# EAGLE design PCB-ETH-TALLY (EAGLE 7.7.0)
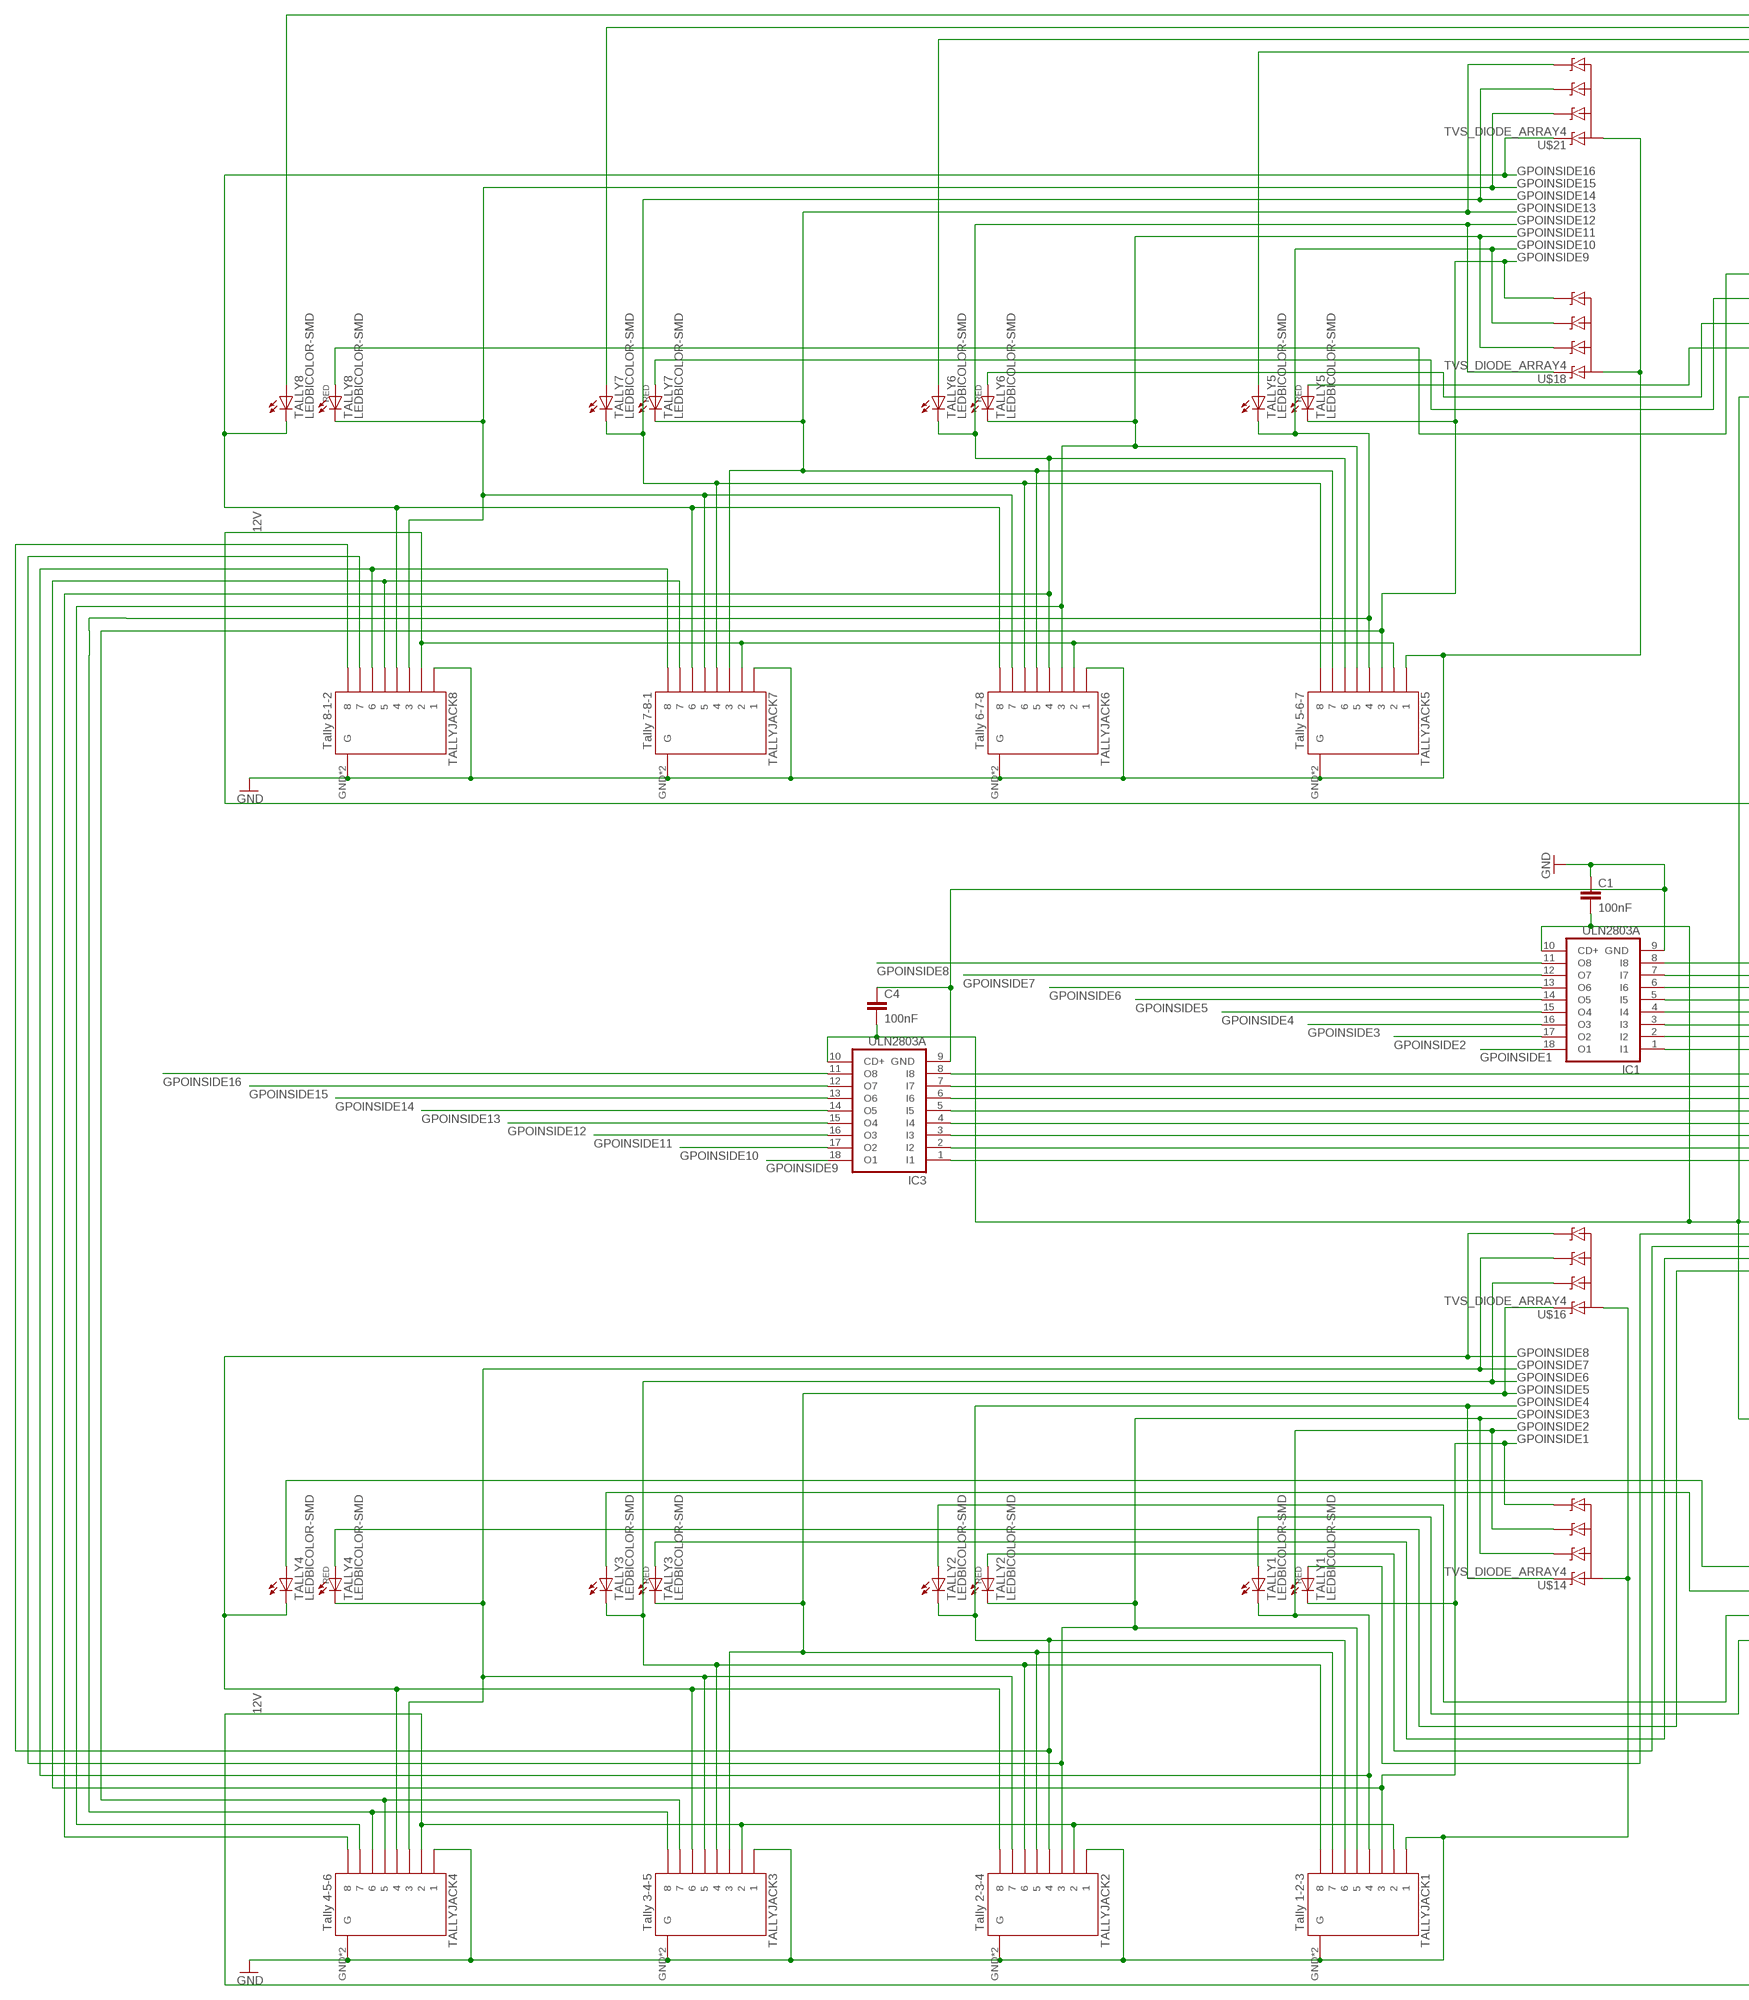
[diagram p0: schematic, sheet 1, part 1 of 2]
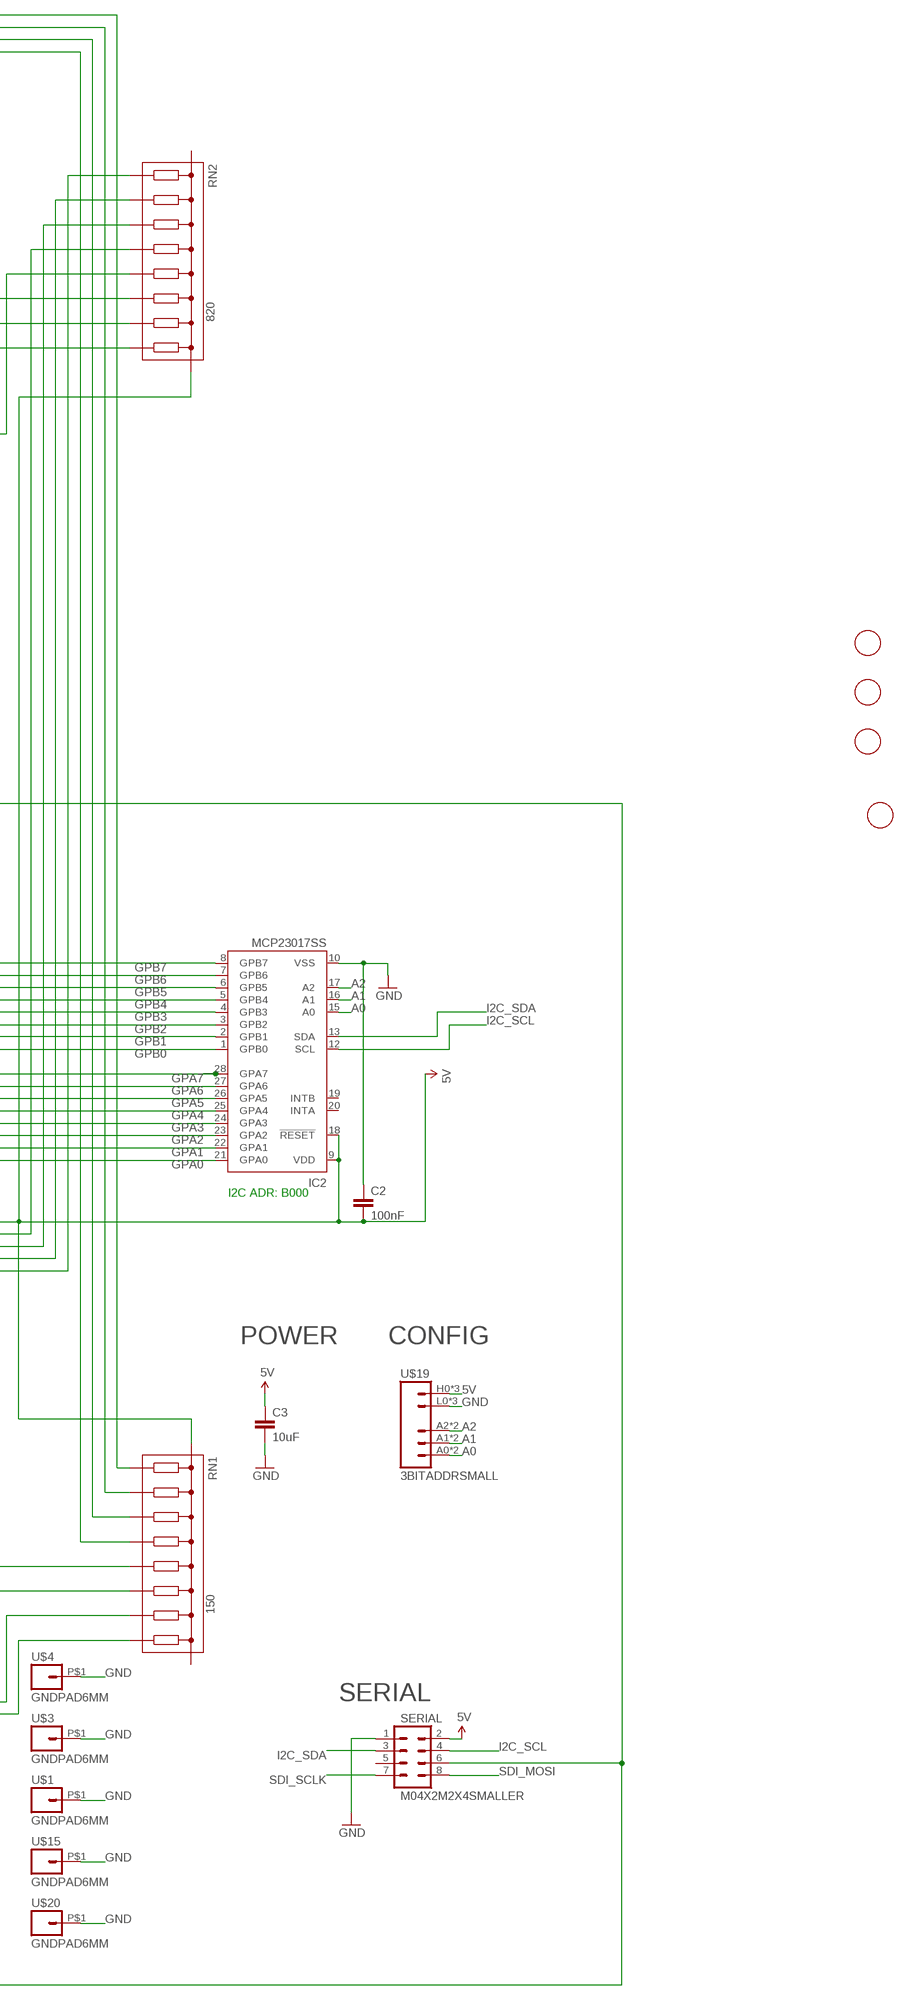
[diagram p1: schematic, sheet 1, part 2 of 2]

## Parts
C1  100nF  CAP0805  [0805]
C2  100nF  CAP0603-CAP  [0603-CAP]
C3  10uF  CAP0805  [0805]
C4  100nF  CAP0805  [0805]
IC1  ULN2803A  ULN2803ASO18W  [SO18W]
IC2  MCP23017SS  [SSOP28]
IC3  ULN2803A  ULN2803ASO18W  [SO18W]
RN1  150  EXBE  [EXBE]
RN2  820  EXBE  [EXBE]
SERIAL  M04X2M2X4SMALLER  [M2X4SMALLER]
TALLY1  LEDBICOLOR-SMD  [LEDBICOLOR-SMD]
TALLY2  LEDBICOLOR-SMD  [LEDBICOLOR-SMD]
TALLY3  LEDBICOLOR-SMD  [LEDBICOLOR-SMD]
TALLY4  LEDBICOLOR-SMD  [LEDBICOLOR-SMD]
TALLY5  LEDBICOLOR-SMD  [LEDBICOLOR-SMD]
TALLY6  LEDBICOLOR-SMD  [LEDBICOLOR-SMD]
TALLY7  LEDBICOLOR-SMD  [LEDBICOLOR-SMD]
TALLY8  LEDBICOLOR-SMD  [LEDBICOLOR-SMD]
TALLYJACK1  Tally 1-2-3  RJ45-8_GNDUPRIGHT  [RJ45-8_GND_UPRIGHT]
TALLYJACK2  Tally 2-3-4  RJ45-8_GNDUPRIGHT  [RJ45-8_GND_UPRIGHT]
TALLYJACK3  Tally 3-4-5  RJ45-8_GNDUPRIGHT  [RJ45-8_GND_UPRIGHT]
TALLYJACK4  Tally 4-5-6  RJ45-8_GNDUPRIGHT  [RJ45-8_GND_UPRIGHT]
TALLYJACK5  Tally 5-6-7  RJ45-8_GNDUPRIGHT  [RJ45-8_GND_UPRIGHT]
TALLYJACK6  Tally 6-7-8  RJ45-8_GNDUPRIGHT  [RJ45-8_GND_UPRIGHT]
TALLYJACK7  Tally 7-8-1  RJ45-8_GNDUPRIGHT  [RJ45-8_GND_UPRIGHT]
TALLYJACK8  Tally 8-1-2  RJ45-8_GNDUPRIGHT  [RJ45-8_GND_UPRIGHT]
U$1  GNDPAD6MM  [3.2MMPAD6MM]
U$3  GNDPAD6MM  [3.2MMPAD6MM]
U$4  GNDPAD6MM  [3.2MMPAD6MM]
U$5  FIDUCIAL  [FIDUCIAL_1MM]
U$6  FIDUCIAL  [FIDUCIAL_1MM]
U$8  FIDUCIAL  [FIDUCIAL_1MM]
U$9  FIDUCIAL  [FIDUCIAL_1MM]
U$14  TVS_DIODE_ARRAY4  [SOT23-6L]
U$15  GNDPAD6MM  [3.2MMPAD6MM]
U$16  TVS_DIODE_ARRAY4  [SOT23-6L]
U$18  TVS_DIODE_ARRAY4  [SOT23-6L]
U$19  3BITADDRSMALL  [3BITADDR_SMALL]
U$20  GNDPAD6MM  [3.2MMPAD6MM]
U$21  TVS_DIODE_ARRAY4  [SOT23-6L]

## Nets
5V [Power]: C1.2 C2.2 C3.1 C4.2 IC1.10(CD+) IC2.9(VDD) IC2.18(!RESET) IC3.10(CD+) RN1.1(POL) RN2.6(POL) SERIAL.2 U$19.H0(VCC) U$19.H1(VCC) U$19.H2(VCC)
12V [Power]: SERIAL.6 TALLYJACK1.2 TALLYJACK2.2 TALLYJACK3.2 TALLYJACK4.2 TALLYJACK5.2 TALLYJACK6.2 TALLYJACK7.2 TALLYJACK8.2
A0: IC2.15(A0) U$19.A0 U$19.AS0(A0)
A1: IC2.16(A1) U$19.A1 U$19.AS1(A1)
A2: IC2.17(A2) U$19.A2 U$19.AS2(A2)
GND [Power]: C1.1 C2.1 C3.2 C4.1 IC1.9(GND) IC2.10(VSS) IC3.9(GND) SERIAL.1 TALLYJACK1.1 TALLYJACK1.GND1(G) TALLYJACK1.GND(G) TALLYJACK2.1 TALLYJACK2.GND1(G) TALLYJACK2.GND(G) TALLYJACK3.1 TALLYJACK3.GND1(G) TALLYJACK3.GND(G) TALLYJACK4.1 TALLYJACK4.GND1(G) TALLYJACK4.GND(G) TALLYJACK5.1 TALLYJACK5.GND1(G) TALLYJACK5.GND(G) TALLYJACK6.1 TALLYJACK6.GND1(G) TALLYJACK6.GND(G) TALLYJACK7.1 TALLYJACK7.GND1(G) TALLYJACK7.GND(G) TALLYJACK8.1 TALLYJACK8.GND1(G) TALLYJACK8.GND(G) U$1.P$1 U$3.P$1 U$4.P$1 U$14.2(GND) U$14.5(GND) U$15.P$1 U$16.2(GND) U$16.5(GND) U$18.2(GND) U$18.5(GND) U$19.L0(GND) U$19.L1(GND) U$19.L2(GND) U$20.P$1 U$21.2(GND) U$21.5(GND)
GPA0: IC2.21(GPA0) IC3.1(I1)
GPA1: IC2.22(GPA1) IC3.2(I2)
GPA2: IC2.23(GPA2) IC3.3(I3)
GPA3: IC2.24(GPA3) IC3.4(I4)
GPA4: IC2.25(GPA4) IC3.5(I5)
GPA5: IC2.26(GPA5) IC3.6(I6)
GPA6: IC2.27(GPA6) IC3.7(I7)
GPA7: IC2.28(GPA7) IC3.8(I8)
GPB0: IC1.1(I1) IC2.1(GPB0)
GPB1: IC1.2(I2) IC2.2(GPB1)
GPB2: IC1.3(I3) IC2.3(GPB2)
GPB3: IC1.4(I4) IC2.4(GPB3)
GPB4: IC1.5(I5) IC2.5(GPB4)
GPB5: IC1.6(I6) IC2.6(GPB5)
GPB6: IC1.7(I7) IC2.7(GPB6)
GPB7: IC1.8(I8) IC2.8(GPB7)
GPOINSIDE1: IC1.18(O1) TALLY1.P$2(C) TALLYJACK1.3 TALLYJACK7.7 TALLYJACK8.5 U$14.6(D)
GPOINSIDE2: IC1.17(O2) TALLY1.P$4(C1) TALLYJACK1.4 TALLYJACK7.8 TALLYJACK8.6 U$14.4(C)
GPOINSIDE3: IC1.16(O3) TALLY2.P$2(C) TALLYJACK1.5 TALLYJACK2.3 TALLYJACK8.7 U$14.3(B)
GPOINSIDE4: IC1.15(O4) TALLY2.P$4(C1) TALLYJACK1.6 TALLYJACK2.4 TALLYJACK8.8 U$14.1(A)
GPOINSIDE5: IC1.14(O5) TALLY3.P$2(C) TALLYJACK1.7 TALLYJACK2.5 TALLYJACK3.3 U$16.1(A)
GPOINSIDE6: IC1.13(O6) TALLY3.P$4(C1) TALLYJACK1.8 TALLYJACK2.6 TALLYJACK3.4 U$16.3(B)
GPOINSIDE7: IC1.12(O7) TALLY4.P$2(C) TALLYJACK2.7 TALLYJACK3.5 TALLYJACK4.3 U$16.4(C)
GPOINSIDE8: IC1.11(O8) TALLY4.P$4(C1) TALLYJACK2.8 TALLYJACK3.6 TALLYJACK4.4 U$16.6(D)
GPOINSIDE9: IC3.18(O1) TALLY5.P$2(C) TALLYJACK3.7 TALLYJACK4.5 TALLYJACK5.3 U$18.6(D)
GPOINSIDE10: IC3.17(O2) TALLY5.P$4(C1) TALLYJACK3.8 TALLYJACK4.6 TALLYJACK5.4 U$18.4(C)
GPOINSIDE11: IC3.16(O3) TALLY6.P$2(C) TALLYJACK4.7 TALLYJACK5.5 TALLYJACK6.3 U$18.3(B)
GPOINSIDE12: IC3.15(O4) TALLY6.P$4(C1) TALLYJACK4.8 TALLYJACK5.6 TALLYJACK6.4 U$18.1(A)
GPOINSIDE13: IC3.14(O5) TALLY7.P$2(C) TALLYJACK5.7 TALLYJACK6.5 TALLYJACK7.3 U$21.6(D)
GPOINSIDE14: IC3.13(O6) TALLY7.P$4(C1) TALLYJACK5.8 TALLYJACK6.6 TALLYJACK7.4 U$21.4(C)
GPOINSIDE15: IC3.12(O7) TALLY8.P$2(C) TALLYJACK6.7 TALLYJACK7.5 TALLYJACK8.3 U$21.3(B)
GPOINSIDE16: IC3.11(O8) TALLY8.P$4(C1) TALLYJACK6.8 TALLYJACK7.6 TALLYJACK8.4 U$21.1(A)
I2C_SCL: IC2.12(SCL) SERIAL.4
I2C_SDA: IC2.13(SDA) SERIAL.3
N$1: RN2.10 TALLY5.P$1(A)
N$2: RN2.9 TALLY6.P$1(A)
N$3: RN2.8 TALLY7.P$1(A)
N$4: RN2.7 TALLY8.P$1(A)
N$5: RN2.5 TALLY1.P$1(A)
N$6: RN2.4 TALLY2.P$1(A)
N$7: RN2.2 TALLY4.P$1(A)
N$8 [Power]: RN2.3 TALLY3.P$1(A)
N$9: RN1.10 TALLY1.P$3(A1)
N$10: RN1.9 TALLY2.P$3(A1)
N$11: RN1.8 TALLY3.P$3(A1)
N$12: RN1.7 TALLY4.P$3(A1)
N$13: RN1.5 TALLY5.P$3(A1)
N$14: RN1.4 TALLY6.P$3(A1)
N$15: RN1.3 TALLY7.P$3(A1)
N$16: RN1.2 TALLY8.P$3(A1)
SDI_MOSI: SERIAL.8
SDI_SCLK: SERIAL.7
Unconnected: IC2.19(INTB) IC2.20(INTA) RN1.6(POL) RN2.1(POL) SERIAL.5

## Notes on the sheet
- I2C ADR: B000
- POWER | CONFIG
- SERIAL

## Library data of the parts
C1-C4 = SparkFun:CAP: Capacitor Standard 0603 ceramic capacitor, and 0.1" leaded capacitor.
IC1 IC3 = uln-udn:ULN2803A: DRIVER ARRAY
IC2 = microchip:MCP23017: http://ww1.microchip.com/downloads/en/DeviceDoc/21952a.pdf Source: http://ww1.microchip.com/downloads/en/DeviceDoc/21952a.pdf; MF: MICROCHIP; MPN: MCP23017-E/SS; OC_FARNELL: 1467674; OC_NEWARK: 31K2960
RN1 RN2 = m-pad-2.1:EXB*: Panasonic EXBA,EXBD,EXBE Chip Resistor Networks
SERIAL = SKAARHOJ:M04X2
TALLY1-TALLY8 = SKAARHOJ:LEDBICOLOR-SMD
TALLYJACK1-TALLYJACK8 = SKAARHOJ:RJ45-8_GND
U$1 U$3 U$4 U$15 U$20 = SKAARHOJ:GNDPAD
U$5 U$6 U$8 U$9 = adafruit:FIDUCIAL: For use by pick and place machines to calibrate the vision/machine, 1mm By microbuilder.eu
U$14 U$16 U$18 U$21 = SKAARHOJ:TVS_DIODE_ARRAY4
U$19 = SKAARHOJ:3BITADDR

## Net classes
0 default: width 0.203 mm, drill 0.406 mm, clearance 0.203 mm
1 Power: width 0.406 mm, drill 0.61 mm, clearance 0.203 mm
2 RELAY LINES: width 0.305 mm, clearance 0.254 mm
3 INput lines: clearance 0.254 mm

## Board
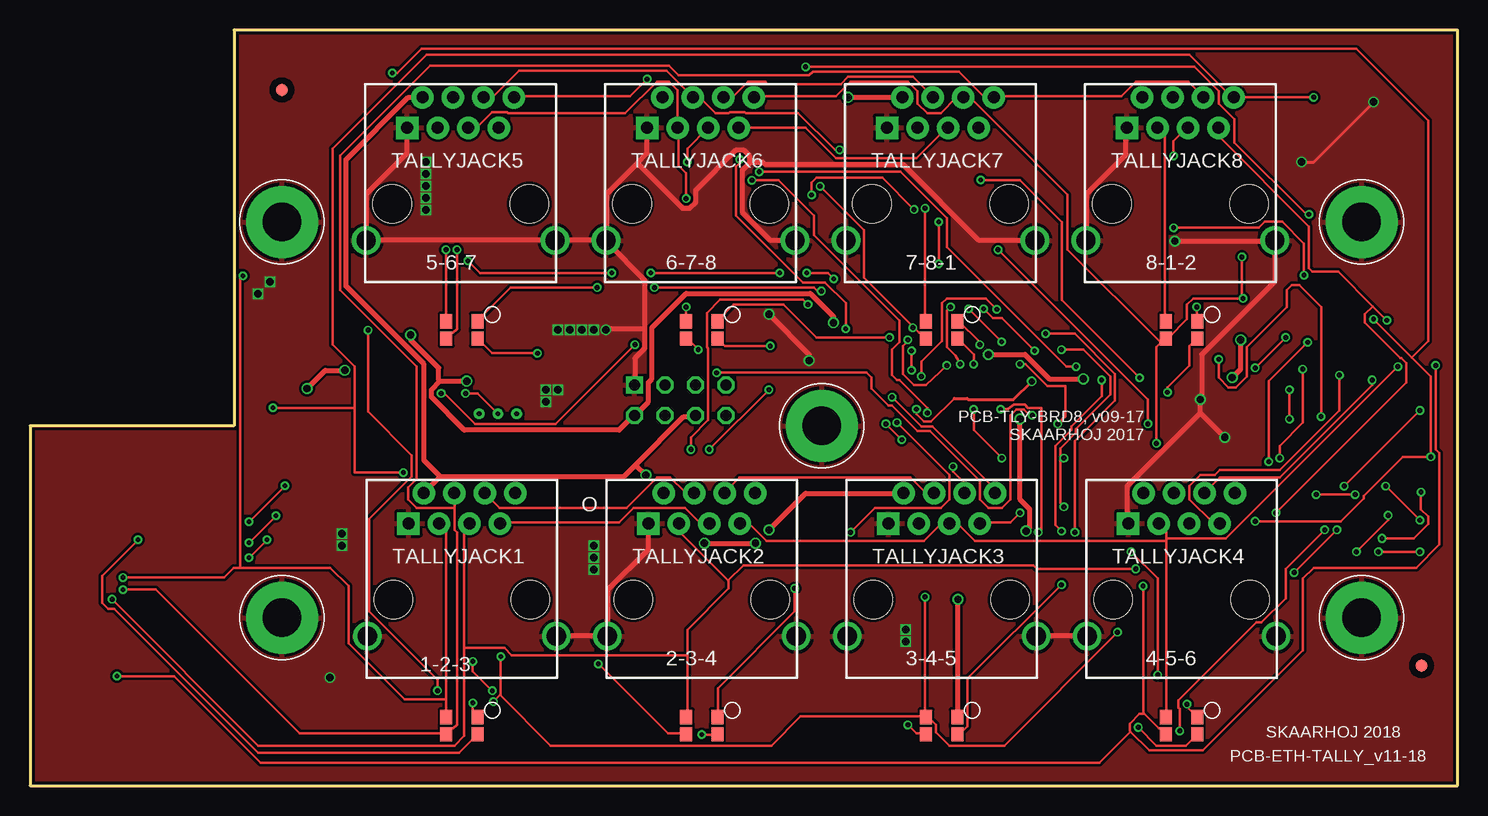
[diagram p2: board, top side]
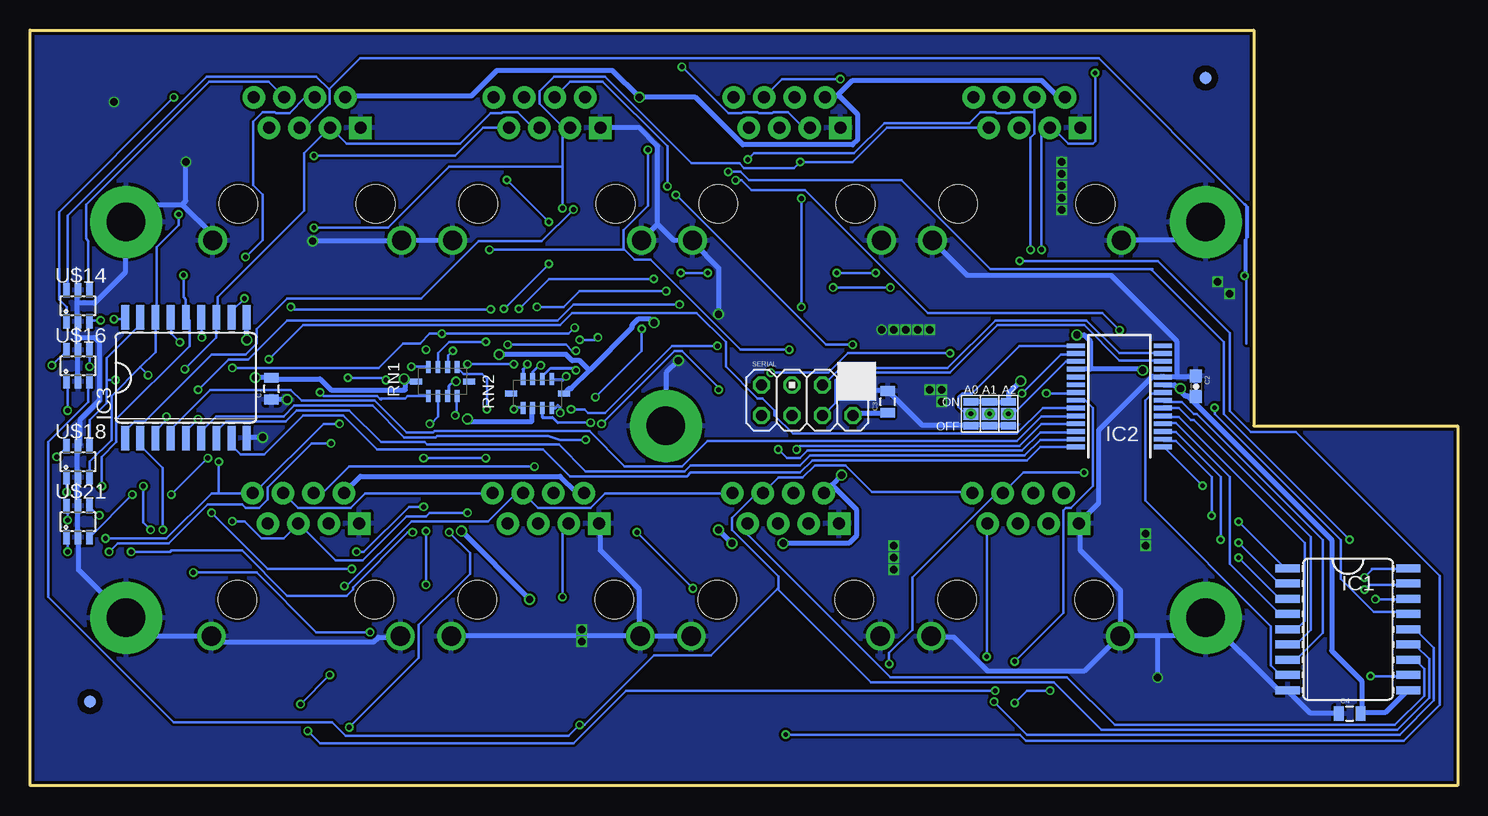
[diagram p3: board, bottom side, seen from below]

Size 119 x 63 mm. Coordinates in mm from the lower left corner, seen from the top.
Outline: 0,0 119,0 119,63 17,63 17,30 0,30 0,0
Copper layers (1*16): Top 0.035mm / dielectric 1.5mm / Bottom 0.035mm
Design rules "Fusion_eagle_rule_v1.1": minimum track width 6mil, minimum drill 12mil, track to track 6mil, track to pad 6mil, pad to pad 6mil, via to via 6mil, smd to smd 0mil, copper to edge 10mil, drill to drill 10mil, minimum pad ring 10mil, minimum via ring 6mil, stop-mask expansion 2mil, vias tented up to drill 100mil, thermal gap 10mil

### Footprints (pad centres in the part's own frame; a part is rotated, then mirrored left to right if it is on the bottom)
0805 = smd 0.8 x 1.2: 1 -0.9,0; 2 0.9,0
0603-CAP = smd 1.1 x 1: 1 -0.85,0; 2 0.85,0
SO18W = smd 0.66 x 2.032: 1 -5.08,-5.029; 2 -3.81,-5.029; 3 -2.54,-5.029; 4 -1.27,-5.029; 5 0,-5.029; 6 1.27,-5.029; 7 2.54,-5.029; 8 3.81,-5.029; 9 5.08,-5.029; 10 5.08,5.029; 11 3.81,5.029; 12 2.54,5.029; 13 1.27,5.029; 14 0,5.029; 15 -1.27,5.029; 16 -2.54,5.029; 17 -3.81,5.029; 18 -5.08,5.029
SSOP28 = smd 0.4 x 1.5: 1 -4.225,-3.625; 2 -3.575,-3.625; 3 -2.925,-3.625; 4 -2.275,-3.625; 5 -1.625,-3.625; 6 -0.975,-3.625; 7 -0.325,-3.625; 8 0.325,-3.625; 9 0.975,-3.625; 10 1.625,-3.625; 11 2.275,-3.625; 12 2.925,-3.625; 13 3.575,-3.625; 14 4.225,-3.625; 15 4.225,3.625; 16 3.575,3.625; 17 2.925,3.625; 18 2.275,3.625; 19 1.625,3.625; 20 0.975,3.625; 21 0.325,3.625; 22 -0.325,3.625; 23 -0.975,3.625; 24 -1.625,3.625; 25 -2.275,3.625; 26 -2.925,3.625; 27 -3.575,3.625; 28 -4.225,3.625
EXBE = smd 1 x 0.5: 1 -2.2,0; 6 2.2,0 | smd 0.4 x 1: 2 -1.2,-1.2; 3 -0.4,-1.2; 4 0.4,-1.2; 5 1.2,-1.2; 7 1.2,1.2; 8 0.4,1.2; 9 -0.4,1.2; 10 -1.2,1.2
M2X4SMALLER = drill 0.9 square: 1 -1.27,3.81 | drill 0.9 octagon: 2 1.27,3.81; 3 -1.27,1.27; 4 1.27,1.27; 5 -1.27,-1.27; 6 1.27,-1.27; 7 -1.27,-3.81; 8 1.27,-3.81
LEDBICOLOR-SMD = smd 1 x 1.2: P$1 1.3,0.725; P$2 -1.3,0.725; P$3 1.3,-0.725; P$4 -1.3,-0.725
RJ45-8_GND_UPRIGHT = drill 1 pad 1.88 square: 1 -4.445,6.35 | drill 1 pad 1.88: 2 -3.175,8.89; 3 -1.905,6.35; 4 -0.635,8.89; 5 0.635,6.35; 6 1.905,8.89; 7 3.175,6.35; 8 4.445,8.89 | drill 1.6: GND -7.88,-3.05; GND1 7.88,-3.05 | hole 3.2: -5.715,0; 5.715,0
3.2MMPAD6MM = drill 3.2 pad 6: P$1 0,0
FIDUCIAL_1MM = smd 1 x 1: 1 0,0
SOT23-6L = smd 0.55 x 1.2: 1 -0.95,-1.3; 2 0,-1.3; 3 0.95,-1.3; 4 0.95,1.3; 5 0,1.3; 6 -0.95,1.3
3BITADDR_SMALL = drill 0.4: A0 -1.565,0; A1 0,0; A2 1.565,0 | smd 1.27 x 1: AS0 -1.565,0; AS1 0,0; AS2 1.565,0 | smd 1.27 x 0.635: H0 -1.565,1; H1 0,1; H2 1.565,1; L0 -1.565,-1; L1 0,-1; L2 1.565,-1

### Placement (x,y rotation side)
C1  98.87,33.09 90 bottom
C2  21.8,33.29 270 bottom
C3  47.5,32 90 bottom
C4  9,6 0 bottom
IC1  9.13,13.03 270 bottom
IC2  28.19,32.45 90 bottom
IC3  106,34 0 bottom
RN1  84.6,33.7 0 bottom
RN2  76.7,32.7 0 bottom
SERIAL  54.21,32.12 270 bottom
TALLY1  36,5 0 top
TALLY2  56,5 0 top
TALLY3  76,5 0 top
TALLY4  96,5 0 top
TALLY5  36,38 0 top
TALLY6  56,38 0 top
TALLY7  76,38 0 top
TALLY8  96,38 0 top
TALLYJACK1  36,15.5 0 top
TALLYJACK2  56,15.5 0 top
TALLYJACK3  76,15.5 0 top
TALLYJACK4  96,15.5 0 top
TALLYJACK5  35.9,48.5 0 top
TALLYJACK6  55.9,48.5 0 top
TALLYJACK7  75.9,48.5 0 top
TALLYJACK8  95.9,48.5 0 top
U$1  111,47 0 top
U$3  21,47 0 top
U$4  66,30 0 top
U$5  21,59 0 bottom
U$6  114,7 0 bottom
U$8  21,58 0 top
U$9  116,10 0 top
U$14  115,40 0 bottom
U$15  21,14 0 top
U$16  115,35 0 bottom
U$18  115,27 0 bottom
U$19  39,31 0 bottom
U$20  111,14 0 top
U$21  115,22 0 bottom

### Tracks (layer width: path | path; a pad name or v marks a point on that pad's centre or on a via)
5V  (via drill 0.61)
  Top 0.406: v26.25,34.62 24.62,34.62 v23.09,33.1 | v100.92,37.16 100.92,34.73 v100.21,34.01 | v66.99,38.59 66.99,39.09 65.06,41.02 54.69,41.02 51.85,38.18 51.85,33.91 51.54,33.61 51.54,31.98 50.43,30.87 SERIAL.2 50.22,30.76 49.1,29.65 36.2,29.65 33.46,32.39 33.46,33 34.17,33.71 | 34.17,33.71 v36.41,33.71 | v87.81,33.91 84.97,33.91 82.94,35.95 v79.89,35.95 | v31.73,37.57 31.73,37.16 34.07,34.83 34.07,33.81 34.17,33.71
  Bottom 0.406: IC1.10 4.2,7.9 6.03,6.07 8.06,6.07 C4.2 8,6.25 8,8.75 10.5,11.25 10.5,20.5 22.5,32.5 22.5,32.49 | 22.5,32.49 22.69,32.49 23.2,33 | 22.5,32.49 21.88,32.49 C2.2 21.67,32.29 | 23.2,33 23.6,33.41 24.52,33.41 IC2.9 | 30.61,34.73 26.35,34.73 v26.25,34.62 | 30.61,34.73 31.73,34.73 IC2.18 | v23.09,33.1 23.2,33 | 87.75,33 93.91,33 94.83,33.91 98.79,33.91 C1.2 98.99,34.01 v100.21,34.01 | 87.75,33 87.71,33 | v100.92,37.16 100.92,38.99 IC3.10 | U$19.H0 40.47,31.98 39.15,31.98 U$19.H1 38.95,31.98 37.52,31.98 U$19.H2 37.42,32.19 37.42,32.69 v36.41,33.71 | 72.37,34.62 68.81,38.18 68.81,38.38 68.31,38.89 67.29,38.89 v66.99,38.59 | 72.37,34.62 73.89,33.1 74.1,33.1 RN2.6 | C3.1 47.58,31.07 50.12,31.07 50.32,30.87 SERIAL.2 | v87.81,33.91 87.71,33.81 87.71,33.2 87.75,33 | v79.89,35.95 74.3,35.95 73.79,35.44 73.18,35.44 72.37,34.62 | 30.61,34.73 30.61,37.06 31.12,37.57 v31.73,37.57 | 87.75,33.75 v87.81,33.91 | RN1.1 86.9,33.71 87.61,33.71 v87.81,33.91
12V  (via drill 0.61)
  Top 0.406: v68.21,57.38 72.68,57.38 TALLYJACK7.2 | 50.48,26.75 49.51,25.79 34.17,25.79 | 50.48,26.75 54.49,30.76 55.4,30.76 SERIAL.6 | 34.17,25.79 32.85,24.46 TALLYJACK1.2 | 50.48,26.75 v51.34,25.89 | v61.6,21.31 64.65,24.36 72.78,24.36 TALLYJACK3.2 | v56.22,20.2 v60.48,20.2 | 34.17,25.79 32.85,27.11 32.85,35.13 26.35,41.63 26.35,52.2 31.53,57.38 32.65,57.38 TALLYJACK5.2
  Bottom 0.406: 51.65,57.59 51.75,57.48 52.66,57.48 TALLYJACK6.2 | 51.65,57.59 50.43,58.8 34.68,58.8 33.36,57.48 32.75,57.48 TALLYJACK5.2 | 51.65,57.59 50.02,55.96 50.02,53.83 50.43,53.42 59.57,53.42 63.53,57.38 v68.21,57.38 70.44,59.62 80.09,59.62 82.23,57.48 92.69,57.48 TALLYJACK8.2 | TALLYJACK3.2 72.88,24.46 73.49,24.46 74.81,25.79 91.47,25.79 92.79,24.46 TALLYJACK4.2 | v51.34,25.89 52.15,25.07 | 52.15,25.07 52.76,24.46 TALLYJACK2.2 | v60.48,20.2 v61.6,21.31 | v56.22,20.2 50.73,20.2 50.12,20.81 50.12,23.04 52.15,25.07
A0
  Bottom 0.203: 40.57,30.97 U$19.AS0 40.67,30.97 40.98,30.97 41.59,31.58 41.59,32.39 41.28,32.69 40.47,32.69 36.51,36.66 31.83,36.66 IC2.15
A1  (via drill 0.41)
  Top 0.203: v36.3,32.69 37.32,32.69 38.95,31.07 U$19.AS1
  Bottom 0.203: 39.05,30.97 U$19.AS1 | v36.3,32.69 33.05,35.95 31.83,35.95 IC2.16
A2
  Bottom 0.203: 37.42,30.97 U$19.AS2 37.32,30.97 37.01,30.97 32.65,35.34 31.83,35.34 IC2.17
GND  (via drill 0.6, 0.61)
  Top 0.254: v106,52 107,52 v112,57
  Top 0.406: TALLYJACK3.GND1 83.95,12.48 88.12,12.48 TALLYJACK4.GND | 97.57,31.07 v97.57,32.19 97.67,32.29 97.67,35.95 103.77,42.04 103.77,45.39 TALLYJACK8.GND1 103.56,45.39 v95.43,45.39 | 97.57,31.07 91.47,24.97 91.47,21.92 TALLYJACK4.1 | 97.57,31.07 v99.6,29.04 | TALLYJACK2.1 51.54,21.82 51.54,19.69 48.19,16.34 48.19,12.48 TALLYJACK2.GND 47.99,12.48 43.92,12.48 TALLYJACK1.GND1 | TALLYJACK5.1 31.43,54.84 31.43,52.71 28.07,49.36 28.07,45.49 TALLYJACK5.GND 28.28,45.49 43.62,45.49 TALLYJACK5.GND1 43.82,45.49 47.89,45.49 TALLYJACK6.GND | TALLYJACK8.1 91.37,54.84 91.37,52.61 88.12,49.36 88.12,45.49 TALLYJACK8.GND | 50.63,51.9 48.09,49.36 48.09,45.49 TALLYJACK6.GND | 50.63,51.9 51.44,52.71 TALLYJACK6.1 | 51.24,38.08 51.24,42.14 48.09,45.29 TALLYJACK6.GND | 51.24,38.08 51.24,36.45 50.43,35.64 50.43,33.41 SERIAL.1 | 59.98,51.9 59.37,51.29 59.37,47.83 61.7,45.49 63.73,45.49 TALLYJACK6.GND1 | 59.98,51.9 59.98,52.51 59.47,53.01 58.86,53.01 55.51,49.66 55.51,48.65 55,48.14 54.39,48.14 50.63,51.9 | TALLYJACK7.GND1 83.75,45.49 79.08,45.49 72.78,51.79 61.3,51.79 61.09,52 60.08,52 59.98,51.9 | v64.95,35.44 64.95,35.95 v61.6,39.3 | 51.24,38.08 48.09,38.08 v48,38
  Bottom 0.406: TALLYJACK3.1 71.46,21.82 71.46,19.59 68.21,16.34 68.21,12.48 TALLYJACK3.GND | TALLYJACK2.GND1 63.94,12.48 68,12.48 TALLYJACK3.GND | TALLYJACK3.GND1 83.85,12.48 68.41,12.48 TALLYJACK3.GND | v97.57,32.19 98.79,32.19 C1.1 | v99.6,29.04 100.82,29.04 IC3.9 | U$16.2 115.04,33.71 115.04,36.25 U$16.5 115.04,36.45 115.04,37.37 | 115.04,37.37 115.04,38.69 U$14.2 115.04,38.89 115.04,40.21 | 115.04,40.21 115.04,41.23 U$14.5 | 115.04,40.21 113.62,40.21 111.08,42.75 111.08,46.92 U$1.P$1 110.88,47.12 109.56,48.44 106.31,48.44 | 106.31,48.44 103.87,46 103.87,45.49 TALLYJACK8.GND1 | 115.04,37.37 113.62,37.37 113.21,36.96 113.21,32.08 114.84,30.46 114.84,28.43 U$18.5 115.04,28.22 115.04,25.89 U$18.2 115.04,25.68 115.04,23.45 U$21.5 115.04,23.25 115.04,20.7 U$21.2 114.94,20.5 114.94,17.96 111.08,14.1 U$20.P$1 110.88,13.9 109.45,12.48 103.97,12.48 TALLYJACK4.GND1 103.66,12.48 103.16,11.97 90.35,11.97 89.95,12.37 88.22,12.37 TALLYJACK4.GND | 23.4,34.12 24.52,34.12 IC2.10 24.72,34.12 25.43,34.12 29.9,29.65 29.9,23.55 31.53,21.92 TALLYJACK1.1 31.43,21.72 31.43,19.59 28.07,16.23 28.07,12.68 TALLYJACK1.GND | 23.4,34.12 21.88,34.12 C2.1 | C4.1 9.99,6.07 12.33,6.07 14.15,7.9 IC1.9 14.36,8.01 14.97,8.01 20.96,14 U$15.P$1 21.16,13.9 22.59,12.48 25.03,12.48 | 25.03,12.48 28.07,12.48 TALLYJACK1.GND | TALLYJACK1.GND1 43.82,12.37 41.99,12.37 39.15,9.53 31.12,9.53 28.28,12.37 TALLYJACK1.GND | TALLYJACK5.GND 27.97,45.49 22.49,45.49 21.06,46.92 U$3.P$1 | TALLYJACK7.GND1 83.85,45.49 88.02,45.49 TALLYJACK8.GND 88.22,45.39 v95.43,45.39 | 66.68,46.82 66.68,53.32 68.21,54.84 71.36,54.84 TALLYJACK7.1
  Bottom 0.406: 66.68,46.82 68,45.49 TALLYJACK7.GND | 66.68,46.82 65.36,45.49 63.84,45.49 TALLYJACK6.GND1 63.73,45.29 61.6,43.16 v61.6,39.3 | U$19.L2 37.52,30.05 38.95,30.05 U$19.L1 39.15,30.05 40.47,30.05 U$19.L0 40.67,30.05 44.63,30.05 47.38,32.8 C3.2 47.58,33 50.02,33 50.32,33.3 SERIAL.1 | v64.95,35.44 65.97,34.42 65.97,30.05 U$4.P$1 | 23.4,34.12 23.4,37.06 28.89,42.55 40.88,42.55 43.72,45.39 TALLYJACK5.GND1 | 25.03,12.48 25.03,9.02 v25,9 | 106.31,48.44 106,48.75 v106,52
  other vias: 19,41 20,42 33,48 33,49 33,50 33,51 33,52 44,38 45,38 46,38 47,38 43,33 44,33 43,32 73,12 73,13 47,18 47,19 47,20 26,20 26,21
  pour Top: 0,0 119,0 119,63 0,63
  pour Bottom: 0,0 119,0 119,63 0,63
GPA0  (via drill 0.41)
  Top 0.203: v34.27,32.69 34.58,32.69 37.12,30.15 43.82,30.15 v50.43,36.76 | v65.16,49.25 65.16,50.27 65.56,50.68 71.05,50.68 v73.69,48.03
  Bottom 0.203: v34.27,32.69 31.83,32.69 IC2.21 | v50.43,36.76 52.66,36.76 v65.16,49.25 | v73.69,48.03 76.33,45.39 81.62,45.39 86.39,40.62 97.57,40.62 100.11,38.08 100.11,36.86 101.02,35.95 103.87,35.95 109.45,30.36 110.27,30.36 110.98,29.65 110.98,29.04 IC3.1
GPA1  (via drill 0.41)
  Top 0.203: v36.91,10.34 36.91,9.53 v38.54,7.9 | v95.84,4.55 95.84,6.38 95.74,6.48 95.74,7.09 102.24,13.59 102.65,13.59 104.68,15.62 104.68,18.06 v107.93,21.31
  Bottom 0.203: v36.91,10.34 32.85,14.41 32.85,22.94 32.65,23.14 32.24,23.14 30.41,24.97 30.41,31.47 31.02,32.08 31.73,32.08 IC2.22 | v38.54,7.9 69.32,7.9 73.69,3.53 94.83,3.53 v95.84,4.55 | v107.93,21.31 107.93,26.5 109.76,28.33 109.76,28.93 IC3.2
GPA2  (via drill 0.41)
  Top 0.203: v99.09,35.54 99.09,34.01 99.91,33.2 100.51,33.2 101.43,34.12 101.43,36.55 104.78,39.91 104.78,41.33 105.19,41.74 105.8,41.74 107.63,39.91 v107.63,30.76
  Bottom 0.203: v99.09,35.54 96.25,38.38 74.81,38.38 73.79,39.4 63.43,39.4 60.99,36.96 60.99,34.93 58.35,32.29 57.94,32.29 56.93,31.27 56.93,30.87 55.4,29.34 36.71,29.34 34.58,31.47 31.83,31.47 IC2.23 | v107.63,30.76 107.63,30.46 108.44,29.65 108.44,29.04 IC3.3
GPA3
  Bottom 0.203: IC2.24 31.83,30.76 34.68,30.76 36.71,28.73 62.52,28.73 64.65,26.6 69.42,26.6 72.37,29.54 74.91,29.54 75.62,29.55 81.72,29.55 82.43,29.54 85.27,29.54 85.38,29.44 87.61,29.44 90.25,32.08 96.35,32.08 97.26,33 103.97,33 107.22,29.75 107.22,29.04 IC3.4
GPA4  (via drill 0.41)
  Top 0.203: v55.1,28.02 55.1,29.04 56.52,30.46 56.52,36.45 56.42,36.55 56.42,39.4 57.54,40.52 64.45,40.52 v64.85,40.11 | v104.98,30.56 v104.98,33
  Bottom 0.203: v55.1,28.02 54.79,28.33 36.51,28.33 34.68,30.15 31.83,30.15 IC2.25 | v64.85,40.11 73.69,40.11 75.01,38.79 97.57,38.79 100.82,35.54 102.44,35.54 v104.98,33 | v104.98,30.56 105.9,29.65 105.9,29.04 IC3.5
GPA5  (via drill 0.41)
  Top 0.203: v61.6,33 v56.62,28.02 | v72.68,28.83 v71.36,30.15
  Bottom 0.203: v56.62,28.02 55.91,27.31 54.79,27.31 54.19,27.92 36.3,27.92 34.78,29.44 31.83,29.44 IC2.26 | v61.6,33 61.6,33.2 64.65,36.25 65.26,36.25 v71.36,30.15 | v72.68,28.83 74.81,28.83 75.83,29.15 81.52,29.15 82.23,29.14 85.07,29.14 85.17,29.04 87.81,29.04 90.46,31.68 96.96,31.68 97.87,30.76 103.46,30.76 104.68,29.54 104.68,29.04 IC3.6
GPA6
  Bottom 0.203: IC2.27 31.83,28.83 34.78,28.83 36.1,27.51 53.98,27.51 54.79,26.7 63.94,26.7 64.45,26.19 72.68,26.19 74.91,28.43 85.88,28.43 86.09,28.63 89.75,28.63 92.39,31.27 96.75,31.27 97.67,30.36 102.65,30.36 103.36,29.65 103.36,29.04 IC3.7
GPA7
  Bottom 0.203: IC2.28 31.83,28.22 34.78,28.22 35.9,27.11 53.78,27.11 54.79,26.09 63.94,26.09 64.24,25.79 74,25.79 76.23,28.02 90.05,28.02 92.89,30.87 96.25,30.87 99.5,27.61 101.43,27.61 102.14,28.33 102.14,28.93 IC3.8
GPB0  (via drill 0.41)
  Top 0.203: v18.25,22 v21.25,25
  Bottom 0.203: v21.25,25 24.5,28.25 IC2.1 | v18.25,22 14.25,18 IC1.1
GPB1  (via drill 0.41)
  Top 0.203: v18.25,20.25 v20.5,22.5
  Bottom 0.203: v20.5,22.5 20.5,25.75 23.5,28.75 24.5,28.75 IC2.2 | v18.25,20.25 15,17 14.25,17 IC1.2
GPB2  (via drill 0.41)
  Top 0.203: v18.25,19 v19.75,20.5
  Bottom 0.203: v19.75,20.5 19.75,25.75 23.5,29.5 24.5,29.5 IC2.3 | v18.25,19 15,15.75 14.25,15.75 IC1.3
GPB3
  Bottom 0.203: IC2.4 24.5,30.25 23.5,30.25 19,25.75 19,18.5 15,14.5 14.25,14.5 IC1.4
GPB4
  Bottom 0.203: IC2.5 24.5,30.75 23.25,30.75 12.75,20.25 12.75,13.75 13.25,13.25 14,13.25 IC1.5
GPB5
  Bottom 0.203: IC2.6 24.5,31.5 23.25,31.5 22.25,30.5 22,30.5 12.25,20.75 12.25,13 13.25,12 14,12 IC1.6
GPB6
  Bottom 0.203: IC2.7 24.5,32 23,32 22,31 21.75,31 11.25,20.5 11.25,12.75 13.5,10.5 14,10.5 IC1.7
GPB7
  Bottom 0.203: IC2.8 24.62,32.69 25.43,32.69 26.04,32.08 26.04,23.75 15.58,13.29 15.58,10.04 14.76,9.22 14.26,9.22 IC1.8
GPOINSIDE1  (via drill 0.41)
  Top 0.203: 34.68,7.19 34.68,21.31 34.17,21.82 TALLYJACK1.3 | 34.68,7.19 34.68,5.77 TALLY1.P$2 | v7.75,17.35 16.19,17.35 17,18.16 17.5,18.16 | 17.5,18.16 25.03,18.16 26.55,16.64 26.55,11.87 31.22,7.19 34.68,7.19 | v95.33,52.51 95.33,53.73 96.45,54.84 TALLYJACK8.5 | 17.5,18.16 17.5,42.25 v17.75,42.5
  Bottom 0.203: v7.75,17.35 7.09,18.01 | 7.09,18.01 7.04,18.06 4.2,18.06 IC1.18 | 94.06,58.04 94.01,57.99 94.01,56.87 95.94,54.94 96.45,54.94 TALLYJACK8.5 | 94.06,58.04 95.13,59.11 104.27,59.11 115.86,47.53 115.86,41.33 U$14.6 | v95.33,52.51 83.55,52.51 81.21,54.84 TALLYJACK7.7 | 17.61,36.86 17.61,48.34 17.76,48.49 | 17.76,48.49 29.9,60.63 91.47,60.63 94.06,58.04 | 7.14,18.06 7.09,18.01 | v17.75,42.5 17.75,45.5 17.5,45.75 17.5,48.25 17.75,48.5 17.76,48.49
GPOINSIDE2  (via drill 0.41)
  Top 0.203: TALLYJACK8.6 97.77,57.48 96.55,58.7 92.18,58.7 90.96,57.48 80.4,57.48 TALLYJACK7.8 80.3,57.48 79.48,57.48 77.45,59.52 65.26,59.52 64.95,59.21 54.08,59.21 53.27,60.02 33.36,60.02 25.84,52.51 25.84,41.33 32.24,34.93 32.24,25.58 31.53,24.87 31.53,23.85 32.24,23.14 35.39,23.14 | 35.39,23.14 35.39,24.36 TALLYJACK1.4 | 35.39,23.14 35.39,21.31 35.59,21.11 35.59,5.06 35.29,4.75 35.19,4.75 34.78,4.35 TALLY1.P$4 34.68,4.35 22.49,4.35 10.5,16.34 v7.75,16.34
  Bottom 0.203: U$14.4 114.13,41.33 114.13,45.39 114.33,45.6 114.33,48.44 104.07,58.7 99.09,58.7 97.87,57.48 TALLYJACK8.6 | v7.75,16.34 7.35,16.74 4.2,16.74 IC1.17
GPOINSIDE3  (via drill 0.41)
  Top 0.203: 111.94,39.96 109.05,42.85 106.92,42.85 106.61,43.16 106.61,46.61 99.09,54.13 99.09,54.84 TALLYJACK8.7 | 111.94,39.96 v113.11,38.79 | 54.79,10.85 54.79,12.98 58.25,16.44 58.25,17.05 58.2,17.1 | 54.79,10.85 54.79,5.77 TALLY2.P$2 | 58.2,17.1 54.19,21.11 54.19,21.82 TALLYJACK2.3 | v6.84,15.52 19.03,3.33 35.39,3.33 36.2,4.14 36.2,11.46 | 36.2,11.46 36.2,21.42 36.61,21.82 TALLYJACK1.5 | 54.79,10.85 40.16,10.85 39.55,11.46 36.2,11.46 | 111.94,39.96 111.28,39.3 111.28,38.59 114.23,35.64 114.33,35.64 114.74,35.23 114.74,33.61 v103.87,22.74 | v92.18,18.06 83.95,18.06 83.65,18.37 59.47,18.37 58.2,17.1
  Bottom 0.203: v113.11,38.79 114.03,38.79 U$14.3 | v6.84,15.52 4.2,15.52 IC1.16 | v103.87,22.74 99.19,18.06 v92.18,18.06
GPOINSIDE4  (via drill 0.41)
  Top 0.203: v107.02,57.38 100.41,57.38 TALLYJACK8.8 100.31,57.48 100.11,57.48 96.65,60.94 33.05,60.94 25.23,53.12 25.23,36.76 27.06,34.93 27.06,31.5 | v47.38,10.14 53.17,4.35 54.69,4.35 TALLY2.P$4 | v31.12,26.09 27.06,26.09 27.06,31.5 | TALLYJACK2.4 55.3,24.46 54.59,24.46 53.37,25.68 52.25,25.68 49.71,23.14 39.15,23.14 37.93,24.36 TALLYJACK1.6 | 27.06,31.5 v20.25,31.5
  Bottom 0.203: v107.02,57.38 116.57,47.83 116.57,40.52 115.96,39.91 115.96,38.79 U$14.1 | v47.38,10.14 47.38,11.05 45.45,12.98 45.45,17.35 38.44,24.36 37.93,24.36 TALLYJACK1.6 37.83,24.46 36.2,26.09 v31.12,26.09 | v20.25,31.5 20.25,31 9.75,20.5 9.75,17.25 7,14.5 4.25,14.5 IC1.15
GPOINSIDE5  (via drill 0.41)
  Top 0.203: v74.61,15.73 74.61,5.77 TALLY3.P$2 | v109.56,24.97 v115.86,31.27 | v105.39,17.76 v108.95,21.31 | v90.66,12.78 81.21,3.33 76.64,3.33 75.52,4.45 75.52,5.06 74.91,5.67 74.71,5.67 TALLY3.P$2 | 39.2,7.55 39.25,7.6 v39.25,10.75 | 39.2,7.55 v38.64,6.99 | TALLYJACK2.5 56.62,21.92 55.81,21.92 54.59,23.14 50.32,23.14 49.1,21.92 39.25,21.92 TALLYJACK1.7 | 39.2,7.55 43.41,3.33 61.8,3.33 64.24,5.77 74.5,5.77 TALLY3.P$2
  Bottom 0.203: v74.61,15.73 74.61,21.31 74.1,21.82 TALLYJACK3.3 | v115.86,31.27 115.86,33.61 U$16.1 | v109.56,24.97 109.56,21.92 v108.95,21.31 | v105.39,17.76 100.11,17.76 95.13,12.78 v90.66,12.78 | v38.64,6.99 35.9,4.25 4.81,4.25 1.96,7.09 1.96,11.46 3.49,12.98 4.1,12.98 IC1.14 | v39.25,10.75 39.25,21.82 TALLYJACK1.7
GPOINSIDE6  (via drill 0.41)
  Top 0.203: v73.18,5.06 73.89,4.35 74.61,4.35 TALLY3.P$4 | TALLYJACK3.4 75.32,24.46 74.61,24.46 73.39,25.68 59.16,25.68 57.94,24.46 TALLYJACK2.6
  Bottom 0.203: 56.67,16.39 56.62,16.44 56.62,17.45 60.48,21.31 60.48,22.33 58.45,24.36 57.94,24.36 TALLYJACK2.6 57.84,24.46 56.62,25.68 54.59,25.68 53.58,26.7 51.03,26.7 48.8,24.46 40.47,24.46 TALLYJACK1.8 | 56.67,16.39 62.21,10.85 66.99,10.85 72.78,5.06 v73.18,5.06 74.1,4.14 92.69,4.14 93.81,5.26 107.02,5.26 117.48,15.73 117.48,28.63 114.13,31.98 114.13,33.61 U$16.3 | 56.67,16.39 48.9,8.61 33.66,8.61 29.7,4.65 5.01,4.65 2.37,7.29 2.37,10.54 3.49,11.66 4.1,11.66 IC1.13
GPOINSIDE7  (via drill 0.41)
  Top 0.203: 94.72,20.6 94.72,21.21 94.11,21.82 TALLYJACK4.3 | 94.72,20.6 94.72,20.4 | 94.72,20.4 94.72,5.77 TALLY4.P$2 | v114.03,34.93 99.7,20.6 94.72,20.6 | 94.72,20.4 78.77,20.4 77.35,21.82 76.64,21.82 TALLYJACK3.5 76.54,21.82 75.93,21.82 74.5,20.4 61.4,20.4 59.98,21.82 59.27,21.82 TALLYJACK2.7
  Bottom 0.203: v114.03,34.93 114.03,36.25 U$16.4 | IC1.12 4.1,10.44 3.49,10.44 2.78,9.73 2.78,7.5 5.21,5.06 28.58,5.06 32.54,9.02 47.28,9.02 59.16,20.91 59.16,21.82 TALLYJACK2.7
GPOINSIDE8  (via drill 0.41)
  Top 0.203: 92.84,6.02 92.79,6.07 v92.79,16.64 | 92.84,6.02 94.11,4.75 94.22,4.75 94.62,4.35 TALLY4.P$4 | v117.18,35.03 117.18,28.02 117.48,27.72 117.48,20.09 115.55,18.16 107.02,18.16 106.1,17.25 106.1,11.26 97.77,2.92 93.3,2.92 91.73,4.5 | 91.73,4.5 91.67,4.55 91.67,5.16 92.49,5.97 92.79,5.97 92.84,6.02 | v7.25,9.12 12.02,9.12 19.23,1.91 89.14,1.91 91.73,4.5 | v76.94,26.6 76.94,26.19 77.86,25.28 77.86,24.46 TALLYJACK3.6
  Bottom 0.203: v92.79,16.64 92.59,16.64 87.2,22.03 80.8,22.03 78.47,24.36 77.96,24.36 TALLYJACK3.6 77.86,24.36 76.64,23.14 72.27,23.14 71.05,24.36 60.48,24.36 TALLYJACK2.8 | v117.18,35.03 115.96,36.25 U$16.6 | v7.25,9.12 4.2,9.12 IC1.11 | v76.94,26.6 92.39,26.6 94.52,24.46 95.33,24.46 TALLYJACK4.4
GPOINSIDE9  (via drill 0.41)
  Top 0.203: v34.68,44.68 34.68,38.79 TALLY5.P$2 | v112,38.89 115.2,35.69 | 115.2,35.69 116.77,34.12 v116.77,27.41 114.43,27.41 111.18,24.16 111.18,23.96 109.25,22.03 v102.14,22.03 | v82.53,22.74 81.72,21.92 79.18,21.92 TALLYJACK3.7 | v30.21,59.41 30.61,59.41 32.65,61.45 110.57,61.45 116.57,55.45 116.57,37.06 115.2,35.69
  Bottom 0.203: v34.68,44.68 34.68,54.23 34.07,54.84 TALLYJACK5.3 33.97,54.84 33.76,54.84 32.44,53.52 30.41,53.52 30.21,53.73 v30.21,59.41 | v116.77,27.41 115.96,28.22 U$18.6 | v112,38.89 111.18,38.89 111.08,38.99 IC3.18 | v82.53,22.74 85.68,22.74 85.99,22.43 87.61,22.43 91.27,18.77 93.5,18.77 96.55,21.82 TALLYJACK4.5 96.65,21.82 97.87,20.6 99.7,20.6 101.12,22.03 v102.14,22.03
GPOINSIDE10  (via drill 0.41)
  Top 0.203: v35.59,44.68 35.59,38.08 35.29,37.77 35.19,37.77 34.78,37.37 TALLY5.P$4 | v111.89,33.81 111.89,33.41 104.17,25.68 99.19,25.68 97.97,24.46 TALLYJACK4.6 | v59.16,52.2 59.16,51.9 58.86,51.59 58.86,47.53 64.45,41.94 66.28,41.94 68,40.21 v68,38.08 | v71.86,32.39 74.3,29.95 75.22,29.95 80.4,24.77 80.4,24.46 TALLYJACK3.8
  Bottom 0.203: v35.59,44.68 35.59,54.03 35.29,54.33 35.29,56.16 | 35.29,56.16 35.29,57.38 TALLYJACK5.4 | 112.61,33.81 112.61,35.64 109.86,38.38 109.86,38.99 IC3.17 | 112.61,33.81 112.61,31.88 114.03,30.46 114.03,28.33 U$18.4 | TALLYJACK3.8 80.5,24.36 91.07,24.36 92.28,23.14 96.65,23.14 97.87,24.36 TALLYJACK4.6 | v111.89,33.81 112.61,33.81 | 35.29,56.16 37.22,56.16 37.32,56.06 38.44,56.06 38.54,56.16 39.76,56.16 40.67,55.25 47.78,55.25 50.32,52.71 58.66,52.71 v59.16,52.2 | v68,38.08 68,36.25 v71.86,32.39
GPOINSIDE11  (via drill 0.41)
  Top 0.203: v109.15,34.22 109.15,31.27 104.17,26.29 99.19,26.29 98.79,25.89 97.57,25.89 96.65,24.97 96.65,23.85 98.58,21.92 99.09,21.92 TALLYJACK4.7 | v54.69,39.91 54.69,38.79 TALLY6.P$2 | v54.69,48.95 54.69,51.08 54.08,51.69 54.08,54.84 TALLYJACK6.3 53.98,54.94 53.98,57.99 53.27,58.7 52.25,58.7 49.61,56.06 39.86,56.06 39.76,56.16 38.54,56.16 37.32,54.94 36.61,54.94 TALLYJACK5.5 | v106.61,47.63 106.41,47.63 100.41,53.62 100.41,55.55 99.09,56.87 99.09,57.89 97.06,59.92 v64.65,59.92
  Bottom 0.203: 109.81,34.88 108.54,36.15 108.54,38.99 IC3.16 108.44,39.09 108.44,44.89 106.61,46.71 v106.61,47.63 | 109.81,34.88 112.2,32.49 112.2,28.83 114.03,27 114.03,25.79 U$18.3 | 109.81,34.88 v109.15,34.22 | v54.69,48.95 v54.69,39.91 | v64.65,59.92 60.79,56.06 59.67,56.06 59.57,56.16 58.35,56.16 58.25,56.06 57.13,56.06 57.03,56.16 55.81,56.16 54.59,54.94 54.08,54.94 TALLYJACK6.3
GPOINSIDE12  (via drill 0.41)
  Top 0.203: v115.96,24.46 115.96,23.04 116.57,22.43 116.57,21.82 115.35,20.6 v112.71,20.6 | v106.51,36.96 103.26,33.71 v103.26,27 | v55.71,36.35 54.79,37.27 TALLY6.P$4 | v67.49,53.01 67.09,53.01 64.04,56.06 59.67,56.06 59.57,56.16 58.35,56.16 58.25,56.06 57.13,56.06 55.81,57.38 55.3,57.38 TALLYJACK6.4 55.2,57.48 53.07,59.62 40.77,59.62 38.64,57.48 37.83,57.48 TALLYJACK5.6 | v93.2,30.15 93.2,32.19 v80.7,44.68
  Bottom 0.203: v115.96,24.46 115.96,25.68 U$18.1 | v112.71,20.6 107.63,20.6 103.87,24.36 103.26,24.36 | 103.26,24.36 100.51,24.36 TALLYJACK4.8 100.41,24.46 100.21,24.46 94.52,30.15 v93.2,30.15 | v106.51,36.96 107.22,37.67 107.22,38.99 IC3.15 | 103.26,24.36 v103.26,27 | v55.71,36.35 59.77,36.35 67.29,43.87 68.61,43.87 69.48,44.73 | 69.48,44.73 69.53,44.78 69.53,46.31 67.49,48.34 v67.49,53.01 | v80.7,44.68 69.53,44.68 69.48,44.73
GPOINSIDE13  (via drill 0.41)
  Top 0.203: v113.01,24.97 v115.86,22.13 | v74.61,48.14 74.61,38.79 TALLY7.P$2 | v54.79,52 54.79,53.12 TALLYJACK6.5 | v106.2,42.55 106.2,45.19 104.38,47.02 102.95,47.02 102.44,46.51 v95.33,46.51
  Bottom 0.203: v115.86,22.13 115.86,23.25 U$21.6 | v113.01,24.97 113.01,27.41 111.79,28.63 111.79,30.56 105.7,36.66 105.7,38.79 105.9,38.99 IC3.14 106,39.09 106,40.52 106.2,40.72 v106.2,42.55 | 74.61,51.59 74.61,54.23 TALLYJACK7.3 74.3,54.64 76.54,56.87 76.54,57.89 75.32,59.11 71.05,59.11 63.84,51.9 59.87,51.9 59.47,51.49 55.3,51.49 v54.79,52 50.43,52 47.58,54.84 39.15,54.84 TALLYJACK5.7 | 74.61,51.59 v74.61,48.14 | v95.33,46.51 89.14,46.51 84.06,51.59 74.61,51.59
GPOINSIDE14  (via drill 0.41)
  Top 0.203: v51.44,58.91 50.02,57.48 40.37,57.48 TALLYJACK5.8 | 73.64,38.23 69.53,42.35 69.53,46.31 v65.87,49.97 | 73.64,38.23 74.1,37.77 74.2,37.77 74.61,37.37 TALLY7.P$4 | v113.21,22.53 113.21,22.13 v110.57,19.49 | v87.1,21.11 87.1,28.73 90.46,32.08 90.46,34.32 87.1,37.67 v84.67,37.67 | v73.59,38.18 73.64,38.23 | v102.14,34.83 v104.68,37.37 | TALLYJACK6.6 57.84,57.48 58.66,57.48 59.87,58.7 61.3,58.7 61.5,58.5 67.6,58.5 68.21,59.11 73.59,59.11 75.22,57.48 TALLYJACK7.4
  Bottom 0.203: v51.44,58.91 56.32,58.91 57.74,57.48 TALLYJACK6.6 | v65.87,49.97 65.87,53.32 71.25,58.7 74,58.7 75.22,57.48 TALLYJACK7.4 | v113.21,22.53 113.32,22.53 114.03,23.25 U$21.4 | v110.57,19.49 107.32,19.49 107.22,19.59 101.33,19.59 97.57,15.83 92.59,15.83 92.08,16.34 92.08,16.54 87.51,21.11 v87.1,21.11 | v73.59,38.18 74.1,37.67 v84.67,37.67 85.68,37.67 86.49,36.86 87.92,36.86 89.95,34.83 v102.14,34.83 | v104.68,37.37 104.68,38.99 IC3.13
GPOINSIDE15  (via drill 0.41)
  Top 0.203: v107.22,24.26 v110.47,24.26 | v104.17,27.31 104.17,28.33 106.1,30.26 v106.1,34.73 | TALLY8.P$2 94.62,38.79 94.62,54.23 94.01,54.84 TALLYJACK8.3 | TALLYJACK6.7 59.16,54.84 64.65,54.84 67.19,52.3 73.89,52.3 76.44,54.84 TALLYJACK7.5
  Bottom 0.203: v110.47,24.26 114.03,20.7 U$21.3 | v104.17,27.31 v107.22,24.26 | v106.1,34.73 103.46,37.37 103.46,38.99 IC3.12 103.36,39.09 103.36,40.72 96.15,47.93 96.15,52.71 94.01,54.84 TALLYJACK8.3 93.91,54.84 92.59,53.52 83.14,53.52 80.6,56.06 79.69,56.06 79.58,56.16 78.37,56.16 77.15,54.94 76.54,54.94 TALLYJACK7.5
GPOINSIDE16  (via drill 0.41)
  Top 0.203: TALLYJACK6.8 60.38,57.48 67.19,57.48 68.41,58.7 73.18,58.7 74,57.89 74,56.87 74.81,56.06 75.93,56.06 77.25,57.38 77.76,57.38 TALLYJACK7.6 77.86,57.38 78.37,57.38 86.49,49.25 86.49,44.68 94.22,36.96 TALLY8.P$4 | 101.02,40.62 96.96,40.62 96.45,40.11 96.45,38.89 94.93,37.37 94.72,37.37 TALLY8.P$4 | v112.4,19.49 v115.86,19.49 | v93.91,28.53 93.91,36.55 94.62,37.27 TALLY8.P$4 | 101.02,40.62 v101.02,44.07 | 101.02,40.62 v101.12,40.62
  Bottom 0.203: v101.12,40.62 102.14,39.6 102.14,39.09 IC3.11 | v115.86,19.49 115.86,20.6 U$21.1 | v112.4,19.49 111.69,20.2 107.42,20.2 104.17,23.45 101.33,23.45 101.02,23.14 99.91,23.14 99.19,23.85 99.19,24.87 95.54,28.53 v93.91,28.53 | v101.02,44.07 99.6,45.49 99.6,49.25 100.41,50.07 100.41,55.35 99.6,56.16 98.58,56.16 98.48,56.06 97.36,56.06 96.04,57.38 95.33,57.38 TALLYJACK8.4
I2C_SCL
  Bottom 0.203: IC2.12 24.62,35.44 28.18,35.44 31.12,38.38 38.34,38.38 42.3,34.42 51.24,34.42 51.85,33.81 51.85,31.88 52.86,30.87 SERIAL.4
I2C_SDA
  Bottom 0.203: IC2.13 24.62,36.05 28.18,36.05 30.92,38.79 38.54,38.79 42.5,34.83 51.44,34.83 52.86,33.41 SERIAL.3
N$1  (via drill 0.41)
  Top 0.203: v77.55,35.13 77.15,35.84 76.44,36.55 76.44,39.6 v76.74,39.91 | v65.97,41.23 65.67,41.23 65.36,41.53 v52.05,41.53 | v47.28,41.53 40.06,41.53 37.32,38.79 TALLY5.P$1
  Bottom 0.203: v76.74,39.91 74.5,39.91 73.18,41.23 v65.97,41.23 | v47.28,41.53 v52.05,41.53
  Bottom 0.254: 78,34 RN2.10 77.9,34.7 77.55,35.05 v77.55,35.13
N$2  (via drill 0.41)
  Top 0.203: v76.43,35.03 74.71,33.41 73.69,33.41 72.78,34.32 72.78,36.66 73.18,37.06 v73.18,37.16 | v71.66,37.37 65.56,37.37 62.82,40.11 58.66,40.11 57.33,38.79 TALLY6.P$1
  Bottom 0.203: v73.18,37.16 71.86,37.16 v71.66,37.37
  Bottom 0.254: v76.43,35.03 76.57,35.03 77.1,34.5 RN2.9
N$3  (via drill 0.41)
  Top 0.203: v73.49,36.25 v73.49,34.62 | v79.18,36.76 79.18,36.96 77.35,38.79 TALLY7.P$1
  Bottom 0.203: v73.49,34.62 73.69,34.83 | v73.49,36.25 73.79,36.25 74.3,36.76 v79.18,36.76
  Bottom 0.254: RN2.8 76.3,34.1 75.6,34.8 73.67,34.8 v73.49,34.62
N$4  (via drill 0.41)
  Top 0.203: v74.3,34.12 74.3,35.34 76.03,37.06 76.03,40.21 76.44,40.62 79.69,40.62 v80.6,39.7 | v97.26,39.91 97.26,38.79 TALLY8.P$1
  Bottom 0.203: v80.6,39.7 97.06,39.7 v97.26,39.91
  Bottom 0.254: v74.3,34.12 74.3,34.1 74.6,33.8 75.4,33.8 RN2.7
N$5  (via drill 0.41)
  Top 0.203: v74.81,31.07 74.81,31.47 72.47,33.81 72.27,33.81 71.86,34.22 71.86,36.35 72.47,36.96 72.47,38.79 65.36,45.9 65.36,47.53 62.41,50.47 v60.18,50.47 | v28.18,37.98 28.18,31.17 31.83,27.51 31.83,25.79 28.28,22.23 28.28,14.51 33.97,8.82 v33.97,7.9 | v36.91,6.89 36.91,6.07 37.22,5.77 TALLY1.P$1
  Bottom 0.203: v60.18,50.47 59.67,50.47 58.86,49.66 54.39,49.66 44.13,39.4 29.6,39.4 v28.18,37.98 | v33.97,7.9 35.9,7.9 v36.91,6.89
  Bottom 0.254: v74.81,31.07 74.81,31.51 75,31.7 75.2,31.5 RN2.5
N$6  (via drill 0.41)
  Top 0.203: v72.27,30.26 76.64,25.89 76.64,23.85 75.93,23.14 70.44,23.14 v68.41,21.11 | v63.73,16.44 63.73,14.51 57.33,8.11 57.33,5.77 TALLY2.P$1
  Bottom 0.203: v72.27,30.26 75.01,30.26 | v63.73,16.44 v68.41,21.11
  Bottom 0.254: RN2.4 76.3,30.7 75.46,30.7 75.01,30.26
N$7  (via drill 0.41)
  Top 0.203: v85.99,36.35 87.81,36.35 90.05,34.12 90.05,32.59 87.2,29.75 87.2,29.44 85.88,28.12 85.88,27.31 | 85.88,27.31 85.88,23.55 v86.19,23.25 | v91.78,19.49 94.01,17.25 v94.01,9.22 | v96.45,6.79 96.45,6.58 97.26,5.77 TALLY4.P$1 | v78.67,31.38 78.67,29.65 v81.01,27.31 | 85.88,27.31 v86.19,27.31
  Bottom 0.203: v86.19,23.25 87.41,23.25 91.17,19.49 v91.78,19.49 | v96.45,6.79 v94.01,9.22 | v78.67,31.38 77.96,31.58 RN2.2 | v86.19,27.31 v81.01,27.31
N$8  (via drill 0.61)
  Top 0.406: v82.53,30.56 82.53,23.85 83.34,23.04 83.34,21.52 v83.04,21.21 | v77.35,15.52 77.35,5.77 TALLY3.P$1
  Bottom 0.406: v82.53,30.56 82.33,30.36 77.15,30.36 77.15,31.45 RN2.3 | v77.35,15.52 v83.04,21.21
N$9  (via drill 0.41)
  Top 0.203: v87.2,34.93 86.39,34.93 76.44,44.89 76.44,47.32 72.57,51.19 v60.79,51.19 | v9,20.5 6,17.5 6,15.25 6.5,14.75 7,14.75 19,2.75 35.75,2.75 37.25,4.25 TALLY1.P$3
  Bottom 0.203: v60.79,51.19 59.77,51.19 59.06,50.47 46.36,50.47 38.95,43.06 25.5,43.06 | 25.43,43.06 25.5,43.06 | 85.75,35 RN1.10 85.88,34.93 v87.2,34.93 | v9,20.5 19.5,31 19.5,37 25.5,43 25.5,43.06
N$10  (via drill 0.41)
  Top 0.203: 57.33,4.35 TALLY2.P$3 57.25,4.25 v56,4.25 | v78.25,39.75 v81,37 | v67,42.25 66.5,42.75 v64.75,42.75 | v51.75,42.75 v62.5,42.75 | v48.5,42.75 37.5,42.75 v36.5,43.75
  Bottom 0.203: v78.25,39.75 75.75,42.25 v67,42.25 | v62.5,42.75 v64.75,42.75 | v48.5,42.75 v51.75,42.75 | v36.5,43.75 25,43.75 19,37.75 19,31.25 17.25,29.5 13.5,29.5 1.5,17.5 1.5,6.75 4.5,3.75 36,3.75 36.5,4.25 v56,4.25 | RN1.9 84.97,34.93 84.97,36.05 84.06,36.96 81.01,36.96 v81,37
N$11  (via drill 0.41)
  Top 0.203: v89.34,33.81 89.34,32.49 86.8,29.95 86.8,29.65 85.48,28.33 85.48,21.72 v85.99,21.21 | v85.99,16.74 78.16,8.92 78.16,4.96 77.55,4.35 77.35,4.35 TALLY3.P$3 | v83.75,36.25 81,39 80.25,39 v79.5,39.75 | v75.75,47 v75.75,43.5 | v79.25,50.5 82.5,50.5 86,47 86,40.5 v92.5,34
  Top 0.254: 89.3,33.85 89.35,33.85 89.4,33.8 v89.35,33.8 v89.34,33.81
  Bottom 0.203: v85.99,16.74 v85.99,21.21 | v75.75,43.5 v79.5,39.75 | v79.25,50.5 v75.75,47 | v92.5,34 89.5,34 v89.34,33.81 | 84.25,35 RN1.8 84.16,35.03 84.16,35.84 v83.75,36.25
N$12  (via drill 0.41)
  Top 0.203: 84.26,21.31 v84.06,21.11 84.3,21.36 84.3,31.5 83.2,31.5 82.92,31.78 82.02,31.78 81.52,31.38 v80.91,31.38 | v92.39,4.86 93.91,3.33 96.35,3.33 97.26,4.25 TALLY4.P$3
  Bottom 0.203: v84.06,21.11 82.33,19.38 82.33,17.66 86.59,13.39 86.59,10.65 v92.39,4.86 | v80.91,31.38 80.91,33.91 81.32,34.32 82.84,34.32 83.34,34.83 RN1.7
N$13  (via drill 0.41)
  Top 0.203: v83.55,30.87 83.34,30.87 82.84,31.37 82.23,31.37 81.72,30.87 81.72,23.85 81.01,23.14 79.89,23.14 79.18,23.85 79.18,25.38 75.01,29.54 74,29.54 71.86,31.68 71.56,31.68 70.14,33.1 70.14,34.01 69.73,34.42 v57.23,34.42 | v42.3,36.05 38.54,36.05 37.32,37.27 TALLY5.P$3
  Bottom 0.203: v57.23,34.42 52.46,34.42 50.83,36.05 v42.3,36.05 | v83.55,30.87 83.45,30.97 83.45,32.49 RN1.5
N$14  (via drill 0.41, 0.5)
  Top 0.203: 77.05,32.29 75.11,30.36 74.5,30.36 73.89,30.97 v73.89,31.37 | v61.7,36.66 57.94,36.66 57.33,37.27 TALLY6.P$3
  Top 0.254: 77.05,32.29 78.11,32.29 78.2,32.2 82.01,32.2 82.01,32.21 v83.5,33.7
  Bottom 0.203: v73.89,31.37 72.78,31.37 72.47,31.07 71.05,31.07 65.46,36.66 v61.7,36.66
  Bottom 0.254: v83.5,33.7 83.7,33.7 84.1,33.3 84.1,32.6 RN1.4
N$15  (via drill 0.41)
  Top 0.203: v85.68,30.15 85.88,30.36 85.99,30.36 | 86.29,30.76 86.29,32.27 86.3,32.28 86.3,33.3 84.8,33.3 82.97,35.13 v82.53,35.13 | v78.67,35.13 78.67,35.95 77.35,37.27 TALLY7.P$3
  Top 0.254: 86.29,30.76 v85.68,30.15
  Bottom 0.203: v78.67,35.13 v82.53,35.13 | v85.68,30.15 85.58,30.15 84.97,30.76 84.97,32.49 RN1.3
N$16  (via drill 0.41)
  Top 0.203: v94.83,32.8 94.83,33.2 96.65,35.03 96.65,36.66 97.26,37.27 TALLY8.P$3
  Bottom 0.203: 89.8,32.24 90.05,32.49 94.52,32.49 v94.83,32.8 | 89.8,32.24 89.75,32.19 | RN1.2 85.88,32.49 87.51,32.49 87.71,32.29 89.75,32.29 89.8,32.24

### Text on the board
_tsilk: 5-6-7 | 6-7-8 | 7-8-1 | 8-1-2 | PCB-TLY-BRD8, v09-17 / SKAARHOJ 2017 | O | 2-3-4 | 3-4-5 | 4-5-6 | 1-2-3 | SKAARHOJ 2018 | PCB-ETH-TALLY_v11-18